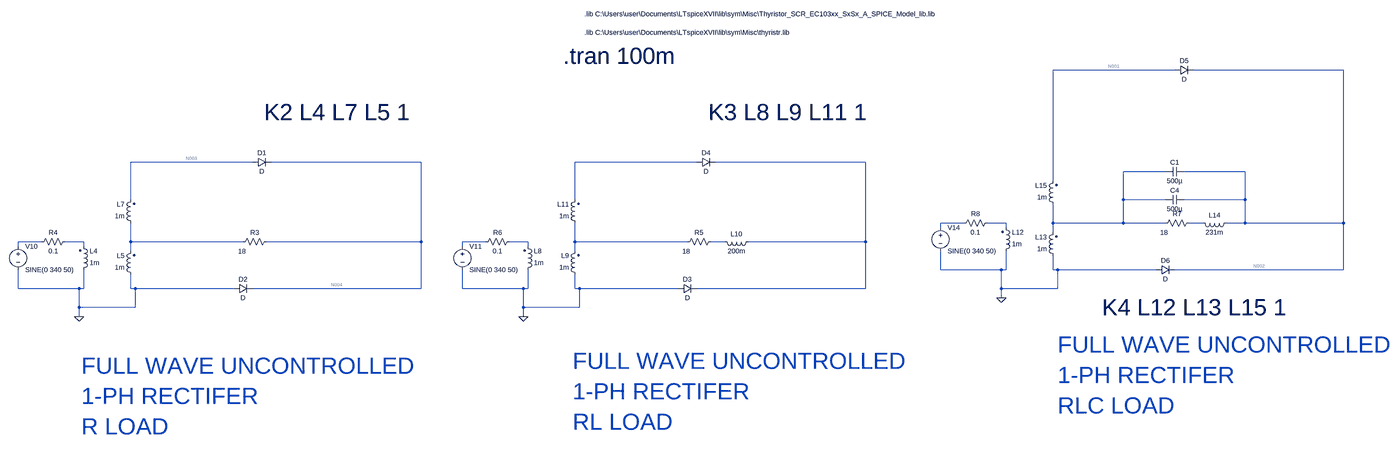
[diagram p0: schematic FULL WAVE RECTIFIER.asc, whole sheet]
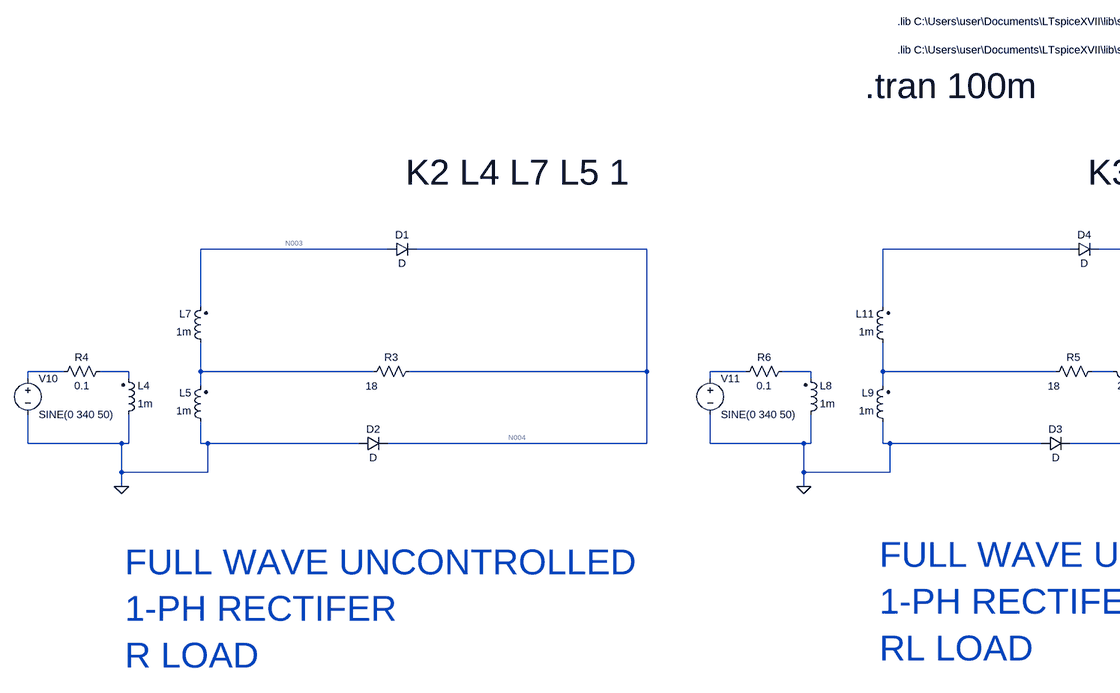
[diagram p1: schematic FULL WAVE RECTIFIER.asc, part, row 1 of 1, column 1 of 2]
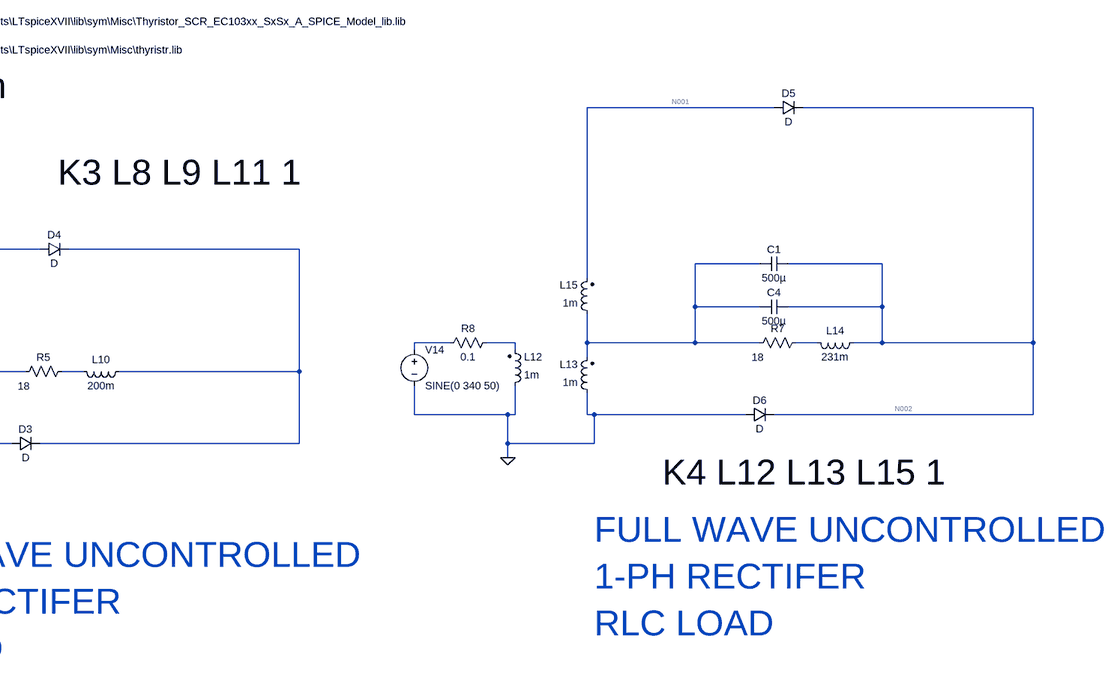
[diagram p2: schematic FULL WAVE RECTIFIER.asc, part, row 1 of 1, column 2 of 2]
FULL WAVE RECTIFIER.asc, the LTspice schematic file:
Version 4
SHEET 1 8056 900
WIRE 5616 -848 5200 -848
WIRE 6192 -848 5680 -848
WIRE 2352 -496 1936 -496
WIRE 2928 -496 2416 -496
WIRE 3984 -496 3568 -496
WIRE 4560 -496 4048 -496
WIRE 5584 -464 5440 -464
WIRE 5856 -464 5648 -464
WIRE 5200 -432 5200 -848
WIRE 1936 -368 1936 -496
WIRE 3568 -368 3568 -496
WIRE 5440 -368 5440 -464
WIRE 5584 -368 5440 -368
WIRE 5856 -368 5856 -464
WIRE 5856 -368 5648 -368
WIRE 4896 -288 4816 -288
WIRE 5040 -288 4976 -288
WIRE 5200 -288 5200 -352
WIRE 5440 -288 5440 -368
WIRE 5440 -288 5200 -288
WIRE 5584 -288 5440 -288
WIRE 5712 -288 5664 -288
WIRE 5856 -288 5856 -368
WIRE 5856 -288 5792 -288
WIRE 6192 -288 6192 -848
WIRE 6192 -288 5856 -288
WIRE 4816 -272 4816 -288
WIRE 5040 -272 5040 -288
WIRE 5200 -256 5200 -288
WIRE 1632 -224 1552 -224
WIRE 1776 -224 1712 -224
WIRE 1936 -224 1936 -288
WIRE 2320 -224 1936 -224
WIRE 2928 -224 2928 -496
WIRE 2928 -224 2400 -224
WIRE 3264 -224 3184 -224
WIRE 3408 -224 3344 -224
WIRE 3568 -224 3568 -288
WIRE 3952 -224 3568 -224
WIRE 4080 -224 4032 -224
WIRE 4560 -224 4560 -496
WIRE 4560 -224 4160 -224
WIRE 1552 -208 1552 -224
WIRE 1776 -208 1776 -224
WIRE 3184 -208 3184 -224
WIRE 3408 -208 3408 -224
WIRE 1936 -192 1936 -224
WIRE 3568 -192 3568 -224
WIRE 4816 -128 4816 -192
WIRE 5024 -128 4816 -128
WIRE 5040 -128 5040 -192
WIRE 5040 -128 5024 -128
WIRE 5200 -128 5200 -176
WIRE 5216 -128 5200 -128
WIRE 5552 -128 5216 -128
WIRE 6192 -128 6192 -288
WIRE 6192 -128 5616 -128
WIRE 1552 -64 1552 -128
WIRE 1760 -64 1552 -64
WIRE 1776 -64 1776 -128
WIRE 1776 -64 1760 -64
WIRE 1936 -64 1936 -112
WIRE 1952 -64 1936 -64
WIRE 2288 -64 1952 -64
WIRE 2928 -64 2928 -224
WIRE 2928 -64 2352 -64
WIRE 3184 -64 3184 -128
WIRE 3392 -64 3184 -64
WIRE 3408 -64 3408 -128
WIRE 3408 -64 3392 -64
WIRE 3568 -64 3568 -112
WIRE 3584 -64 3568 -64
WIRE 3920 -64 3584 -64
WIRE 4560 -64 4560 -224
WIRE 4560 -64 3984 -64
WIRE 5024 -64 5024 -128
WIRE 5216 -64 5216 -128
WIRE 5216 -64 5024 -64
WIRE 5024 -32 5024 -64
WIRE 1760 0 1760 -64
WIRE 1952 0 1952 -64
WIRE 1952 0 1760 0
WIRE 3392 0 3392 -64
WIRE 3584 0 3584 -64
WIRE 3584 0 3392 0
WIRE 1760 32 1760 0
WIRE 3392 32 3392 0
FLAG 1760 32 0
FLAG 3392 32 0
FLAG 5024 -32 0
SYMBOL ind2 1760 -112 M180
WINDOW 0 36 80 Left 2
WINDOW 3 36 40 Left 2
SYMATTR InstName L4
SYMATTR Value 1m
SYMATTR Type ind
SYMBOL ind2 1952 -96 R180
WINDOW 0 36 80 Left 2
WINDOW 3 36 40 Left 2
SYMATTR InstName L5
SYMATTR Value 1m
SYMATTR Type ind
SYMBOL res 2416 -240 R90
WINDOW 0 0 56 VBottom 2
WINDOW 3 33 100 VTop 2
SYMATTR InstName R3
SYMATTR Value 18
SYMBOL res 1728 -240 R90
WINDOW 0 0 56 VBottom 2
WINDOW 3 32 56 VTop 2
SYMATTR InstName R4
SYMATTR Value 0.1
SYMBOL voltage 1552 -224 R0
WINDOW 123 0 0 Left 0
WINDOW 39 0 0 Left 0
SYMATTR InstName V10
SYMATTR Value SINE(0 340 50)
SYMBOL ind2 1952 -272 R180
WINDOW 0 36 80 Left 2
WINDOW 3 36 40 Left 2
SYMATTR InstName L7
SYMATTR Value 1m
SYMATTR Type ind
SYMBOL ind2 3392 -112 M180
WINDOW 0 36 80 Left 2
WINDOW 3 36 40 Left 2
SYMATTR InstName L8
SYMATTR Value 1m
SYMATTR Type ind
SYMBOL ind2 3584 -96 R180
WINDOW 0 36 80 Left 2
WINDOW 3 36 40 Left 2
SYMATTR InstName L9
SYMATTR Value 1m
SYMATTR Type ind
SYMBOL res 4048 -240 R90
WINDOW 0 0 56 VBottom 2
WINDOW 3 33 100 VTop 2
SYMATTR InstName R5
SYMATTR Value 18
SYMBOL ind 4176 -240 R90
WINDOW 0 5 56 VBottom 2
WINDOW 3 32 56 VTop 2
SYMATTR InstName L10
SYMATTR Value 200m
SYMBOL res 3360 -240 R90
WINDOW 0 0 56 VBottom 2
WINDOW 3 32 56 VTop 2
SYMATTR InstName R6
SYMATTR Value 0.1
SYMBOL voltage 3184 -224 R0
WINDOW 123 0 0 Left 0
WINDOW 39 0 0 Left 0
SYMATTR InstName V11
SYMATTR Value SINE(0 340 50)
SYMBOL ind2 3584 -272 R180
WINDOW 0 36 80 Left 2
WINDOW 3 36 40 Left 2
SYMATTR InstName L11
SYMATTR Value 1m
SYMATTR Type ind
SYMBOL ind2 5024 -176 M180
WINDOW 0 36 80 Left 2
WINDOW 3 36 40 Left 2
SYMATTR InstName L12
SYMATTR Value 1m
SYMATTR Type ind
SYMBOL ind2 5216 -160 R180
WINDOW 0 36 80 Left 2
WINDOW 3 36 40 Left 2
SYMATTR InstName L13
SYMATTR Value 1m
SYMATTR Type ind
SYMBOL res 5680 -304 R90
WINDOW 0 0 56 VBottom 2
WINDOW 3 33 100 VTop 2
SYMATTR InstName R7
SYMATTR Value 18
SYMBOL cap 5648 -384 R90
WINDOW 0 0 32 VBottom 2
WINDOW 3 32 32 VTop 2
SYMATTR InstName C4
SYMATTR Value 500µ
SYMBOL ind 5808 -304 R90
WINDOW 0 5 56 VBottom 2
WINDOW 3 32 56 VTop 2
SYMATTR InstName L14
SYMATTR Value 231m
SYMBOL res 4992 -304 R90
WINDOW 0 0 56 VBottom 2
WINDOW 3 32 56 VTop 2
SYMATTR InstName R8
SYMATTR Value 0.1
SYMBOL voltage 4816 -288 R0
WINDOW 123 0 0 Left 0
WINDOW 39 0 0 Left 0
SYMATTR InstName V14
SYMATTR Value SINE(0 340 50)
SYMBOL ind2 5216 -336 R180
WINDOW 0 36 80 Left 2
WINDOW 3 36 40 Left 2
SYMATTR InstName L15
SYMATTR Value 1m
SYMATTR Type ind
SYMBOL diode 2352 -480 R270
WINDOW 0 32 32 VTop 2
WINDOW 3 0 32 VBottom 2
SYMATTR InstName D1
SYMBOL diode 2288 -48 R270
WINDOW 0 32 32 VTop 2
WINDOW 3 0 32 VBottom 2
SYMATTR InstName D2
SYMBOL diode 3920 -48 R270
WINDOW 0 32 32 VTop 2
WINDOW 3 0 32 VBottom 2
SYMATTR InstName D3
SYMBOL diode 3984 -480 R270
WINDOW 0 32 32 VTop 2
WINDOW 3 0 32 VBottom 2
SYMATTR InstName D4
SYMBOL diode 5616 -832 R270
WINDOW 0 32 32 VTop 2
WINDOW 3 0 32 VBottom 2
SYMATTR InstName D5
SYMBOL diode 5552 -112 R270
WINDOW 0 32 32 VTop 2
WINDOW 3 0 32 VBottom 2
SYMATTR InstName D6
SYMBOL cap 5648 -480 R90
WINDOW 0 0 32 VBottom 2
WINDOW 3 32 32 VTop 2
SYMATTR InstName C1
SYMATTR Value 500µ
TEXT 3528 -896 Left 6 !.tran 100m
TEXT 3600 -976 Left 2 !.lib C:\\Users\\user\\Documents\\LTspiceXVII\\lib\\sym\\Misc\\thyristr.lib
TEXT 3600 -1040 Left 2 !.lib C:\\Users\\user\\Documents\\LTspiceXVII\\lib\\sym\\Misc\\Thyristor_SCR_EC103xx_SxSx_A_SPICE_Model_lib.lib
TEXT 2392 -704 Left 6 !K2 L4 L7 L5 1
TEXT 4024 -704 Left 6 !K3 L8 L9 L11 1
TEXT 5368 0 Left 6 !K4 L12 L13 L15 1
TEXT 1768 200 Left 6 ;FULL WAVE UNCONTROLLED\n1-PH RECTIFER\nR LOAD
TEXT 3560 184 Left 6 ;FULL WAVE UNCONTROLLED\n1-PH RECTIFER\nRL LOAD
TEXT 5216 128 Left 6 ;FULL WAVE UNCONTROLLED\n1-PH RECTIFER\nRLC LOAD

The netlist it stands for:
* FULL WAVE RECTIFIER.asc
L4 0 N012 1m
L5 0 N013 1m
R3 N004 N013 18
R4 N012 N011 0.1
V10 N011 0 SINE(0 340 50)
L7 N013 N003 1m
L8 0 N015 1m
L9 0 N016 1m
R5 N017 N016 18
L10 N006 N017 200m
R6 N015 N014 0.1
V11 N014 0 SINE(0 340 50)
L11 N016 N005 1m
L12 0 N009 1m
L13 0 N007 1m
R7 N010 N007 18
C4 N002 N007 500µ
L14 N002 N010 231m
R8 N009 N008 0.1
V14 N008 0 SINE(0 340 50)
L15 N007 N001 1m
D1 N003 N004 D
D2 0 N004 D
D3 0 N006 D
D4 N005 N006 D
D5 N001 N002 D
D6 0 N002 D
C1 N002 N007 500µ
.model D D
.lib standard.dio
.tran 100m
.lib C:\Users\user\Documents\LTspiceXVII\lib\sym\Misc\thyristr.lib
.lib C:\Users\user\Documents\LTspiceXVII\lib\sym\Misc\Thyristor_SCR_EC103xx_SxSx_A_SPICE_Model_lib.lib
K2 L4 L7 L5 1
K3 L8 L9 L11 1
K4 L12 L13 L15 1
* FULL WAVE UNCONTROLLED
* 1-PH RECTIFER
* R LOAD
* FULL WAVE UNCONTROLLED
* 1-PH RECTIFER
* RL LOAD
* FULL WAVE UNCONTROLLED
* 1-PH RECTIFER
* RLC LOAD
.backanno
.end

* Results of the author's LTspice run, read from the files saved beside the schematic
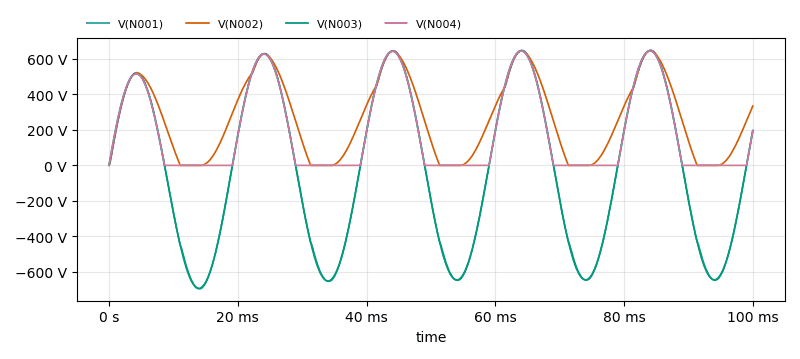
[diagram p3: Transient Analysis of FULL WAVE RECTIFIER.asc, plotted from the saved traces]
* Transient Analysis, 1 run:
*   V(N001): min -695.1 V, max 646.4 V, average -19.54 V, rms 449.1 V, last 195.5 V
*   V(N002): min -948.1 mV, max 645.5 V, average 261.7 V, rms 343 V, last 333.4 V
*   V(N003): min -692.9 V, max 644.7 V, average -19.55 V, rms 449.5 V, last 194.6 V
*   V(N004): min -910.2 mV, max 643.8 V, average 190.7 V, rms 304.7 V, last 193.7 V